# Altium schematic sheet HB_main.SchDoc
size A4
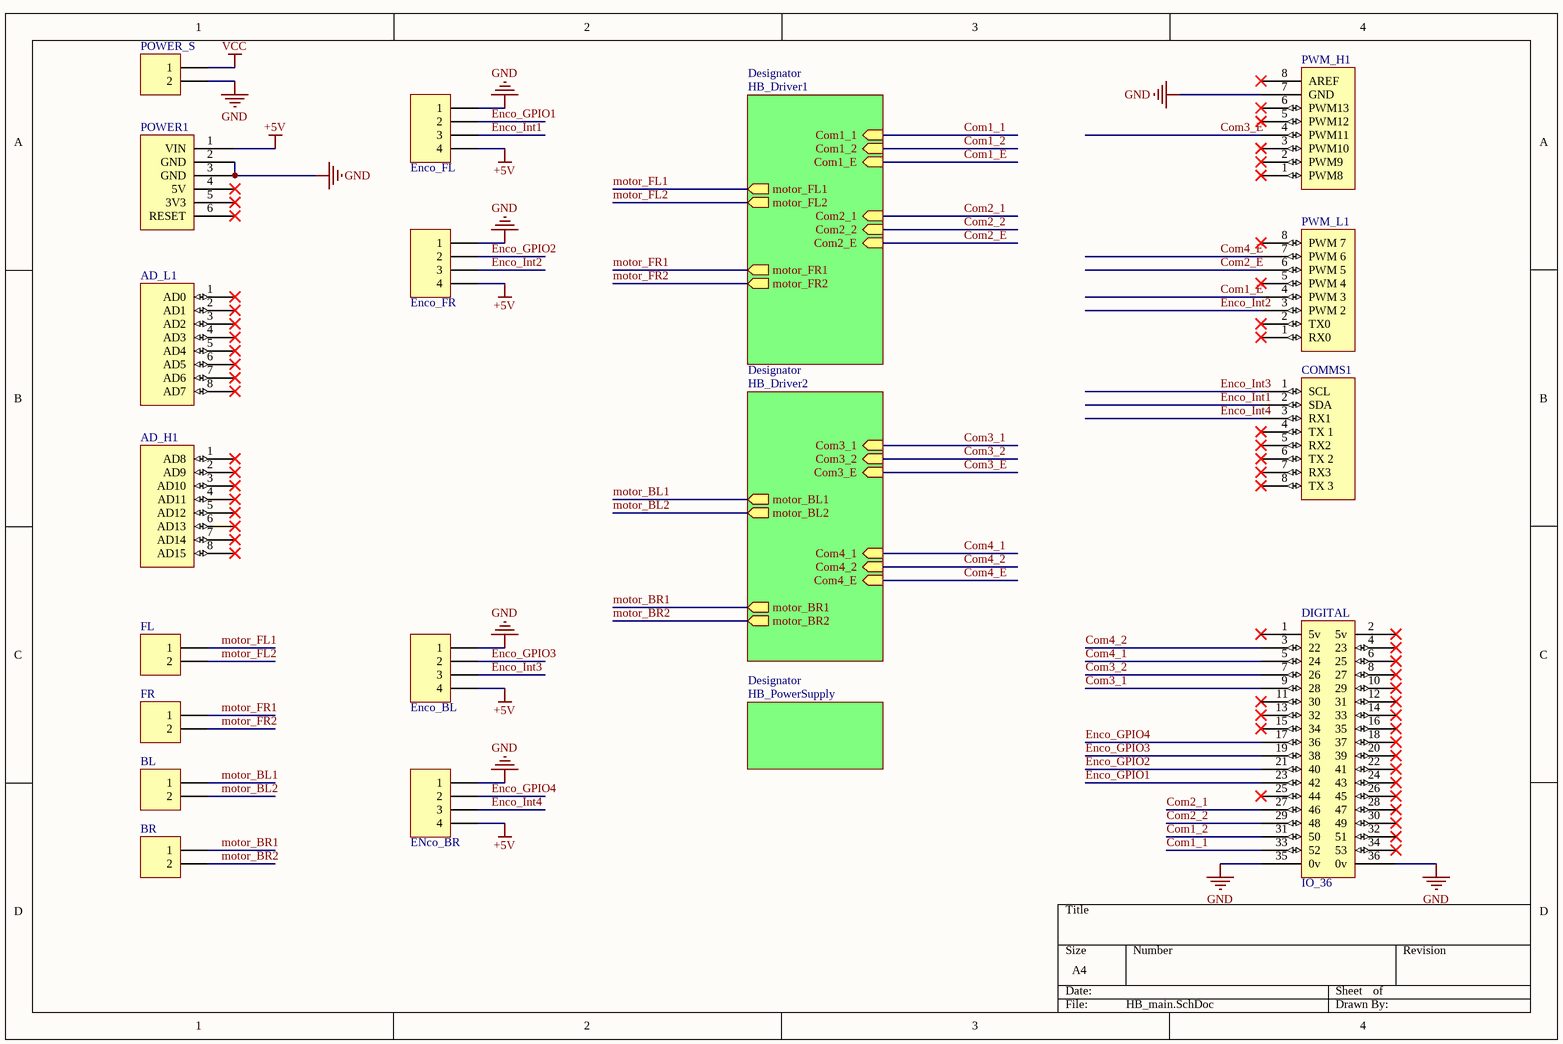
[diagram p0: HB_main.SchDoc]

## Parts
AD_H1  AD_H  [Header 8x1 8.5mm]  (value not drawn)
AD_L1  AD_L  [Header 8x1 8.5mm]  (value not drawn)
COMMS1  Communication  [Header 8x1 8.5mm]  (value not drawn)
DIGITAL  IO_36  [HEADER 36X 8MM]
J3  POWER_S  [Header_2]
J4  FL  [Header_2]
J5  FR  [Header_2]
J6  BL  [Header_2]
J7  BR  [Header_2]
P1  Enco_FL  [MOLEX_22-27-2081]
P2  Enco_FR  [MOLEX_22-27-2081]
P3  Enco_BL  [MOLEX_22-27-2081]
P4  ENco_BR  [MOLEX_22-27-2081]
POWER1  POWER  [Header 6x1 8.5mm]  (value not drawn)
PWM_H1  PWM_H  [Header 8x1 8.5mm]  (value not drawn)
PWM_L1  PWM_L  [Header 8x1 8.5mm]  (value not drawn)

## Sub-sheets
Designator = HB_Driver1: Com2_E (in), Com1_1 (in), Com1_E (in), Com1_2 (in), Com2_2 (in), Com2_1 (in), motor_FR2 (out), motor_FL1 (out), motor_FR1 (out), motor_FL2 (out)
Designator = HB_Driver2: Com4_1 (in), Com3_E (in), Com4_E (in), Com3_2 (in), Com4_2 (in), Com3_1 (in), motor_BL2 (out), motor_BR1 (out), motor_BR2 (out), motor_BL1 (out)
Designator = HB_PowerSupply: no entries

## Nets
+5V: P1.4 P2.4 P3.4 P4.4 POWER1.1(VIN)
GND: DIGITAL.35(0v) DIGITAL.36(0v) J3.2 P1.1 P2.1 P3.1 P4.1 POWER1.2(GND) POWER1.3(GND) PWM_H1.7(GND)
VCC: J3.1
Com1_1: DIGITAL.33(52) ; sheet Designator/Com1_1
Com1_2: DIGITAL.31(50) ; sheet Designator/Com1_2
Com1_E: PWM_L1.4(PWM_3) ; sheet Designator/Com1_E
Com2_1: DIGITAL.27(46) ; sheet Designator/Com2_1
Com2_2: DIGITAL.29(48) ; sheet Designator/Com2_2
Com2_E: PWM_L1.6(PWM_5) ; sheet Designator/Com2_E
Com3_1: DIGITAL.9(28) ; sheet Designator/Com3_1
Com3_2: DIGITAL.7(26) ; sheet Designator/Com3_2
Com3_E: PWM_H1.4(PWM11) ; sheet Designator/Com3_E
Com4_1: DIGITAL.5(24) ; sheet Designator/Com4_1
Com4_2: DIGITAL.3(22) ; sheet Designator/Com4_2
Com4_E: PWM_L1.7(PWM_6) ; sheet Designator/Com4_E
Enco_GPIO1: DIGITAL.23(42) P1.2
Enco_GPIO2: DIGITAL.21(40) P2.2
Enco_GPIO3: DIGITAL.19(38) P3.2
Enco_GPIO4: DIGITAL.17(36) P4.2
Enco_Int1: COMMS1.2(SDA) P1.3
Enco_Int2: P2.3 PWM_L1.3(PWM_2)
Enco_Int3: COMMS1.1(SCL) P3.3
Enco_Int4: COMMS1.3(RX1) P4.3
motor_BL1: J6.1 ; sheet Designator/motor_BL1
motor_BL2: J6.2 ; sheet Designator/motor_BL2
motor_BR1: J7.1 ; sheet Designator/motor_BR1
motor_BR2: J7.2 ; sheet Designator/motor_BR2
motor_FL1: J4.1 ; sheet Designator/motor_FL1
motor_FL2: J4.2 ; sheet Designator/motor_FL2
motor_FR1: J5.1 ; sheet Designator/motor_FR1
motor_FR2: J5.2 ; sheet Designator/motor_FR2

Not connected (* = marked no-connect by the designer): AD_H1 1(AD8)* 2(AD9)* 3(AD10)* 4(AD11)* 5(AD12)* 6(AD13)* 7(AD14)* 8(AD15)*; AD_L1 1(AD0)* 2(AD1)* 3(AD2)* 4(AD3)* 5(AD4)* 6(AD5)* 7(AD6)* 8(AD7)*; COMMS1 4(TX_1)* 5(RX2)* 6(TX_2)* 7(RX3)* 8(TX_3)*; DIGITAL 1(5v)* 2(5v)* 4(23)* 6(25)* 8(27)* 10(29)* 11(30)* 12(31)* 13(32)* 14(33)* 15(34)* 16(35)* 18(37)* 20(39)* 22(41)* 24(43)* 25(44)* 26(45)* 28(47)* 30(49)* 32(51)* 34(53)*; POWER1 4(5V)* 5(3V3)* 6(RESET)*; PWM_H1 1(PWM8)* 2(PWM9)* 3(PWM10)* 5(PWM12)* 6(PWM13)* 8(AREF)*; PWM_L1 1(RX0)* 2(TX0)* 5(PWM_4)* 8(PWM_7)*

## Library data of the parts
AD_H1 = AD_H: Header, 8-Pin; Supplier: Farnell 2505051
AD_L1 = AD_L: Header, 8-Pin; Supplier: Farnell 2505051
COMMS1 = Communication: Header, 8-Pin; Supplier: Farnell 2505051
DIGITAL = IO_36: Header, 36-Pin; Supplier: RS 180-0956
J3-J7 = Connecteur 2: Connecteur; Designer: ECAM 2005; Supplier: ECAM; Type: Connecteur à vis
P1-P4 = Header 4: Header, 4-Pin; LatestRevisionDate: 17-Jul-2002; LatestRevisionNote: Re-released for DXP Platform.; Publisher: Altium Limited; Supplier: Farnell 9731164
POWER1 = POWER: Header, 6-Pin; Supplier: Farnell 2578705
PWM_H1 = PWM_H: Header, 8-Pin; Supplier: Farnell 2505051
PWM_L1 = PWM_L: Header, 8-Pin; Supplier: Farnell 2505051